# EAGLE design transistorBoard (EAGLE 5.11)
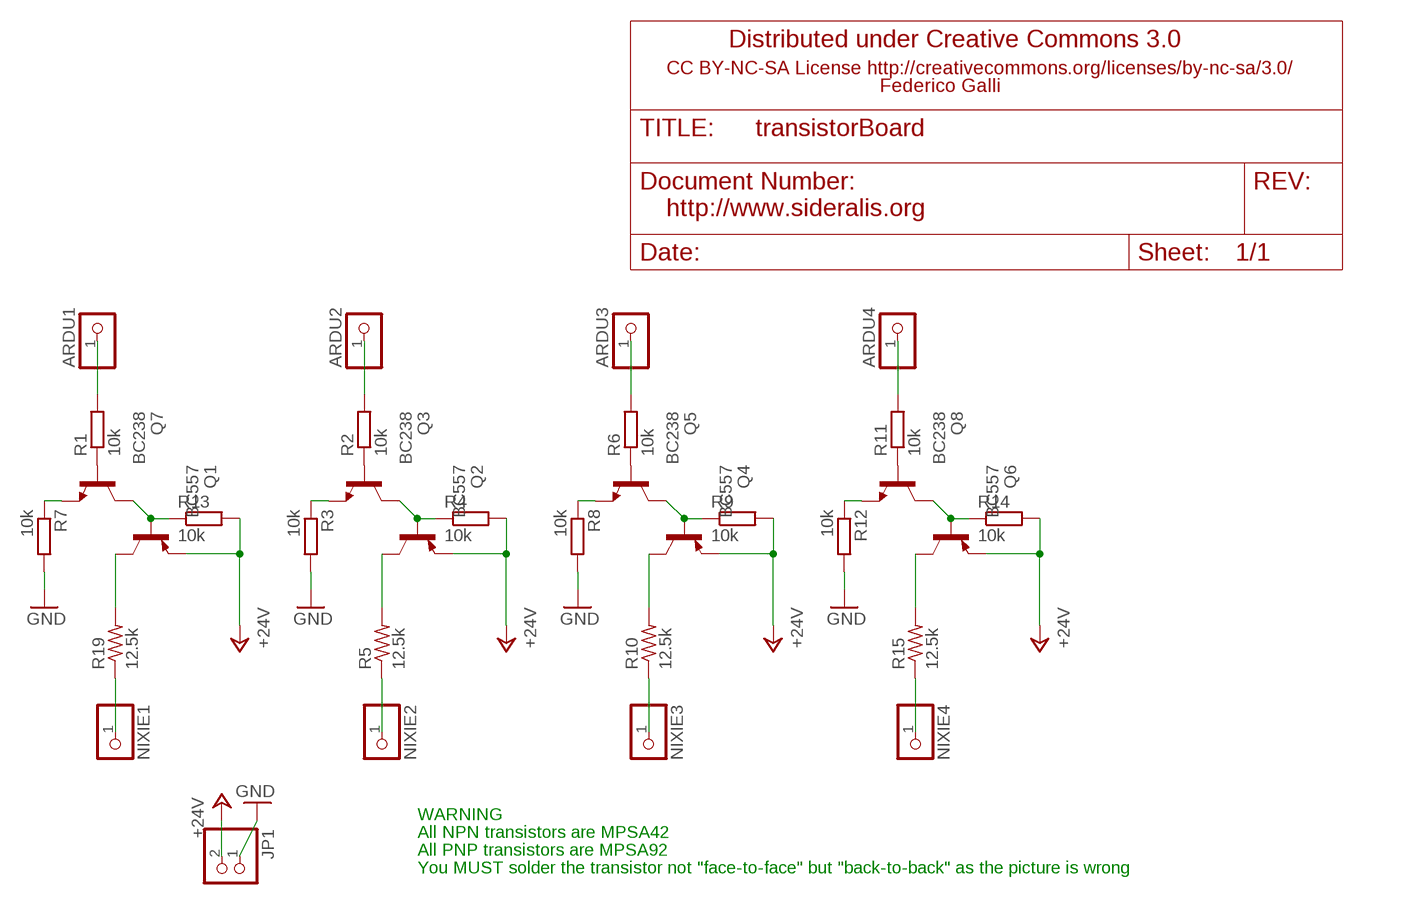
[diagram p0: schematic, sheet 1]

## Parts
ARDU1  PINHD-1X1  [1X01]
ARDU2  PINHD-1X1  [1X01]
ARDU3  PINHD-1X1  [1X01]
ARDU4  PINHD-1X1  [1X01]
JP1  PINHD-1X2  [1X02]
NIXIE1  PINHD-1X1  [1X01]
NIXIE2  PINHD-1X1  [1X01]
NIXIE3  PINHD-1X1  [1X01]
NIXIE4  PINHD-1X1  [1X01]
Q1  BC557  [TO92]
Q2  BC557  [TO92]
Q3  BC238  [TO92]
Q4  BC557  [TO92]
Q5  BC238  [TO92]
Q6  BC557  [TO92]
Q7  BC238  [TO92]
Q8  BC238  [TO92]
R1  10k  R-EU_0207/7  [0207/7]
R2  10k  R-EU_0207/7  [0207/7]
R3  10k  R-EU_0207/7  [0207/7]
R4  10k  R-EU_0207/7  [0207/7]
R5  12.5k  R-US_0207/7  [0207/7]
R6  10k  R-EU_0207/7  [0207/7]
R7  10k  R-EU_0207/7  [0207/7]
R8  10k  R-EU_0207/7  [0207/7]
R9  10k  R-EU_0207/7  [0207/7]
R10  12.5k  R-US_0207/7  [0207/7]
R11  10k  R-EU_0207/7  [0207/7]
R12  10k  R-EU_0207/7  [0207/7]
R13  10k  R-EU_0207/7  [0207/7]
R14  10k  R-EU_0207/7  [0207/7]
R15  12.5k  R-US_0207/7  [0207/7]
R19  12.5k  R-US_0207/7  [0207/7]

## Nets
+24V: JP1.2 Q1.1(E) Q2.1(E) Q4.1(E) Q6.1(E) R4.2 R9.2 R13.2 R14.2
GND: JP1.1 R3.2 R7.2 R8.2 R12.2
N$1: Q2.3(C) R5.2
N$2: Q3.1(E) R3.1
N$3: Q1.3(C) R19.2
N$4: Q7.2(B) R1.1
N$5: Q3.2(B) R2.1
N$6: Q2.2(B) Q3.3(C) R4.1
N$7: NIXIE2.1 R5.1
N$8: ARDU2.1 R2.2
N$9: Q7.1(E) R7.1
N$10: Q4.3(C) R10.2
N$11: Q5.1(E) R8.1
N$12: Q5.2(B) R6.1
N$13: Q4.2(B) Q5.3(C) R9.1
N$14: NIXIE3.1 R10.1
N$15: ARDU3.1 R6.2
N$16: Q6.3(C) R15.2
N$17: Q8.1(E) R12.1
N$18: Q8.2(B) R11.1
N$19: Q1.2(B) Q7.3(C) R13.1
N$20: Q6.2(B) Q8.3(C) R14.1
N$21: NIXIE1.1 R19.1
N$22: NIXIE4.1 R15.1
N$23: ARDU4.1 R11.2
N$26: ARDU1.1 R1.2

## Notes on the sheet
- Distributed under Creative Commons 3.0
- CC BY-NC-SA License http://creativecommons.org/licenses/by-nc-sa/3.0/
- Federico Galli
- http://www.sideralis.org
- WARNING
- All NPN transistors are MPSA42
- All PNP transistors are MPSA92
- You MUST solder the transistor not "face-to-face" but "back-to-back" as the picture is wrong

## Library data of the parts
ARDU1-ARDU4 NIXIE1-NIXIE4 = pinhead:PINHD-1X1: PIN HEADER
JP1 = pinhead:PINHD-1X2: PIN HEADER
Q1 Q2 Q4 Q6 = transistor-pnp:BC557: PNP Transistor
Q3 Q5 Q7 Q8 = transistor-npn:BC238: NPN Transistor
R1-R4 R6-R9 R11-R14 = resistor:R-EU_: RESISTOR, European symbol
R5 R10 R15 R19 = rcl:R-US_: RESISTOR, American symbol

## Net classes
0 default: width 0.051 mm, drill 0.051 mm, clearance 0.051 mm

## Board
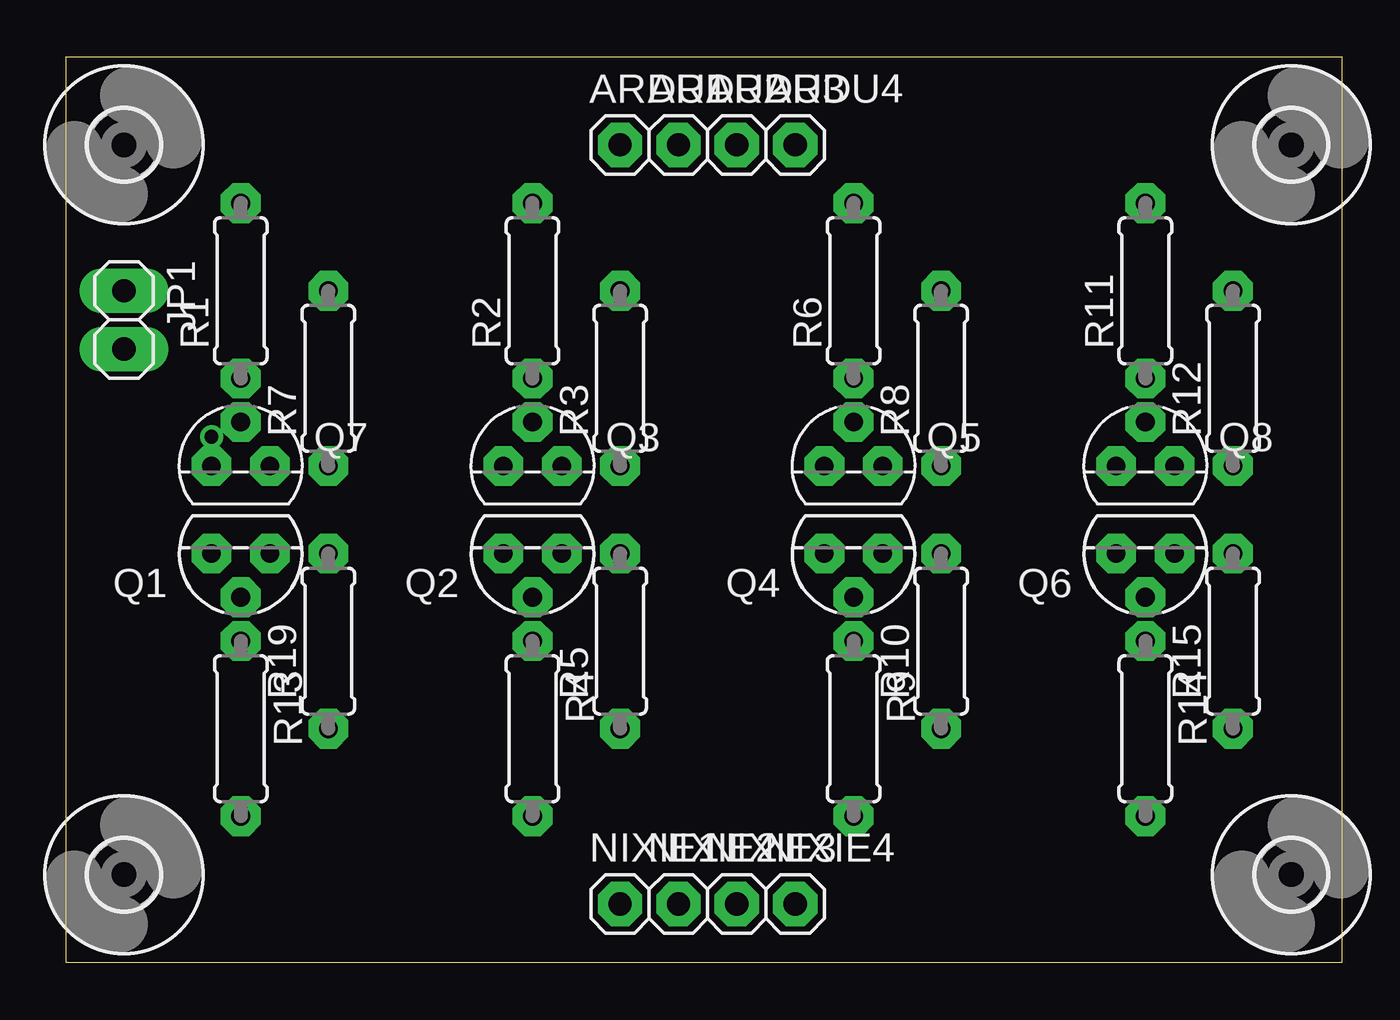
[diagram p1: board, top side]
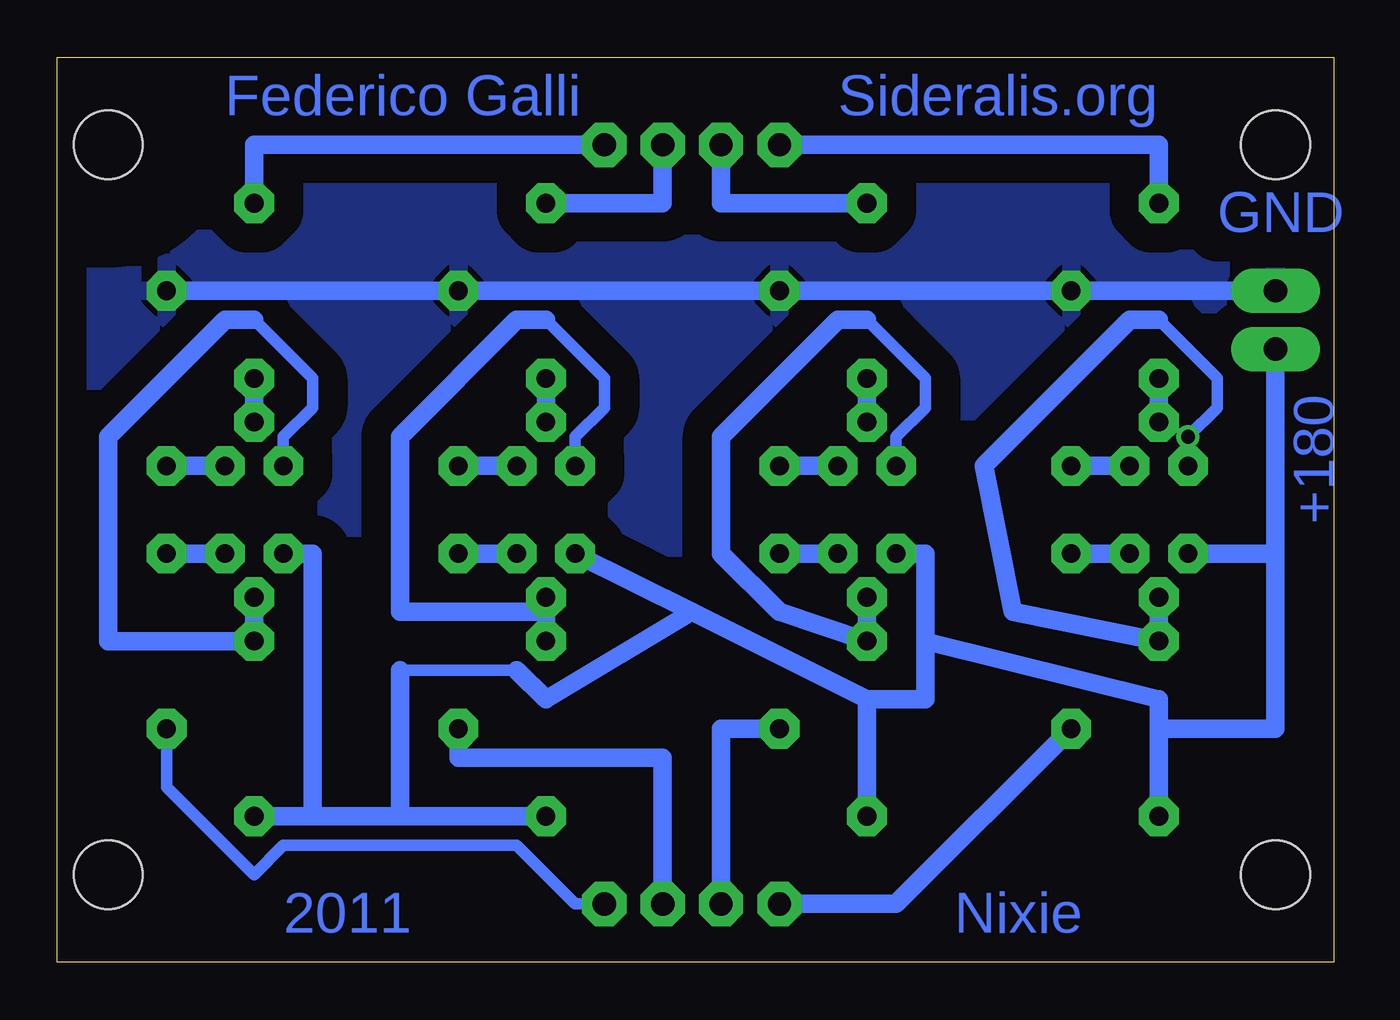
[diagram p2: board, bottom side, seen from below]

Size 55.55 x 39.36 mm. Coordinates in mm from the lower left corner, seen from the top.
Outline: 0,0 55.55,0 55.55,39.36 0,39.36 0,0
Copper layers (1*16): Top 0.035mm / dielectric 1.5mm / Bottom 0.035mm
Design rules "default *": minimum track width 20mil, minimum drill 30mil, track to track 8mil, track to pad 8mil, pad to pad 8mil, via to via 8mil, smd to smd 8mil, copper to edge 40mil, drill to drill 8mil, minimum pad ring 18mil, minimum via ring 8mil, stop-mask expansion 4mil, vias tented up to drill 0mil, thermal gap 10mil

### Footprints (pad centres in the part's own frame; a part is rotated, then mirrored left to right if it is on the bottom)
1X01 = drill 1.016 octagon: 1 0,0
1X02 = drill 1.016 long: 1 -1.27,0; 2 1.27,0
TO92 = drill 0.813 octagon: 1 1.27,0; 2 0,1.905; 3 -1.27,0
0207/7 = drill 0.813 octagon: 1 -3.81,0; 2 3.81,0
3,0 = hole 3: 0,0

### Placement (x,y rotation side)
ARDU1  24.13,35.56 0 top
ARDU2  26.67,35.56 0 top
ARDU3  29.21,35.56 0 top
ARDU4  31.75,35.56 0 top
JP1  2.54,27.94 270 top
NIXIE1  24.13,2.54 0 top
NIXIE2  26.67,2.54 0 top
NIXIE3  29.21,2.54 0 top
NIXIE4  31.75,2.54 0 top
Q1  7.62,17.78 180 top
Q2  20.32,17.78 180 top
Q3  20.32,21.59 0 top
Q4  34.29,17.78 180 top
Q5  34.29,21.59 0 top
Q6  46.99,17.78 180 top
Q7  7.62,21.59 0 top
Q8  46.99,21.59 0 top
R1  7.62,29.21 90 top
R2  20.32,29.21 90 top
R3  24.13,25.4 90 top
R4  20.32,10.16 270 top
R5  24.13,13.97 90 top
R6  34.29,29.21 90 top
R7  11.43,25.4 90 top
R8  38.1,25.4 90 top
R9  34.29,10.16 270 top
R10  38.1,13.97 90 top
R11  46.99,29.21 90 top
R12  50.8,25.4 90 top
R13  7.62,10.16 270 top
R14  46.99,10.16 270 top
R15  50.8,13.97 90 top
R19  11.43,13.97 90 top
U$1  [3,0]  2.54,35.56 0 top
U$2  [3,0]  53.34,35.56 0 top
U$3  [3,0]  53.34,3.81 0 top
U$4  [3,0]  2.54,3.81 0 top

### Tracks (layer width: path | path; a pad name or v marks a point on that pad's centre or on a via)
+24V
  Bottom 0.508: R13.2 7.62,8.89 | 35.56,12.7 40.64,12.7
  Bottom 0.813: 40.64,6.35 R9.2 | 40.64,6.35 44.45,6.35 | 44.45,6.35 R14.2 | 2.54,17.78 JP1.2 | 2.54,17.78 Q1.1 | 2.54,17.78 2.54,10.16 7.62,10.16 | R13.2 7.62,10.16 | Q6.1 44.45,17.78 44.45,6.35 | 40.64,12.7 40.64,6.35 | 20.32,11.43 R4.2 | 20.32,11.43 27.94,15.24 | 27.94,15.24 Q4.1 | 35.56,12.7 34.29,11.43 27.94,15.24 | 7.62,10.16 7.62,11.43 17.78,13.97 | Q2.1 17.78,17.78 17.78,13.97 | 17.78,13.97 17.78,11.43 20.32,11.43
GND
  Bottom 0.813: JP1.1 R7.2 R3.2 R8.2 R12.2
  pour Bottom (isolate 1.27): -2.54,40.64 58.42,40.64 58.42,-1.27 -2.54,-1.27
N$1
  Bottom 0.813: Q2.3 R5.2
N$2
  Bottom 0.813: Q3.1 R3.1
N$3
  Bottom 0.813: Q1.3 R19.2
N$4
  Bottom 0.813: Q7.2 R1.1
N$5
  Bottom 0.813: Q3.2 R2.1
N$6
  Bottom 0.508: Q3.3 19.05,22.86 17.78,24.13 17.78,25.4 20.32,27.94
  Bottom 0.813: Q2.2 R4.1 24.13,15.24 26.67,17.78 26.67,22.86 21.59,27.94 20.32,27.94
N$7
  Bottom 0.813: NIXIE2.1 26.67,10.16 R5.1
N$8
  Bottom 0.813: R2.2 26.67,33.02 ARDU2.1
N$9
  Bottom 0.813: Q7.1 R7.1
N$10
  Bottom 0.813: Q4.3 R10.2
N$11
  Bottom 0.813: Q5.1 R8.1
N$12
  Bottom 0.813: Q5.2 R6.1
N$13
  Bottom 0.508: Q5.3 33.02,22.86 31.75,24.13 31.75,25.4 34.29,27.94
  Bottom 0.813: R9.1 34.29,15.24 | 34.29,15.24 Q4.2 | 34.29,27.94 35.56,27.94 40.64,22.86 40.64,15.24 34.29,15.24
N$14
  Bottom 0.813: R10.1 38.1,8.89 29.21,8.89 NIXIE3.1
N$15
  Bottom 0.813: ARDU3.1 29.21,33.02 R6.2
N$16
  Bottom 0.813: Q6.3 R15.2
N$17
  Bottom 0.813: Q8.1 R12.1
N$18
  Bottom 0.813: Q8.2 R11.1
N$19  (via drill 0.6)
  Bottom 0.508: Q7.3 v6.35,22.86 5.08,24.13 5.08,25.4 7.62,27.94
  Bottom 0.813: Q1.2 R13.1 13.97,15.24 15.24,21.59 8.89,27.94 7.62,27.94
N$20
  Bottom 0.508: Q8.3 45.72,22.86 44.45,24.13 44.45,25.4 46.99,27.94
  Bottom 0.813: Q6.2 R14.1 53.34,13.97 53.34,22.86 48.26,27.94 46.99,27.94
N$21
  Bottom 0.813: NIXIE1.1 19.05,2.54 R19.1
N$22
  Bottom 0.508: R15.1 50.8,7.62 46.99,3.81 45.72,5.08 35.56,5.08 33.02,2.54 NIXIE4.1
N$23
  Bottom 0.813: ARDU4.1 46.99,35.56 R11.2
N$26
  Bottom 0.813: ARDU1.1 7.62,35.56 R1.2

### Text on the board
Bottom: Sideralis.org | Federico Galli | GND | +180 | Nixie | 2011